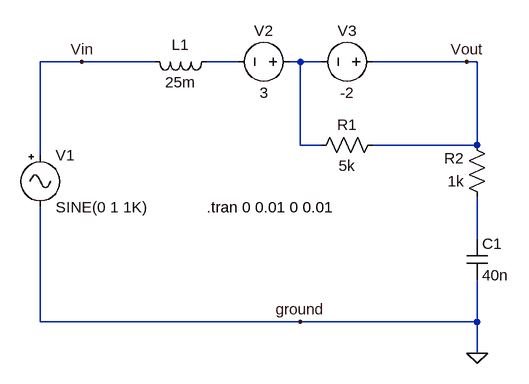
[diagram p0: schematic L__V__V_R__R__C.asc]
L__V__V_R__R__C.asc, the LTspice schematic file:
Version 4
SHEET 1 880 680
WIRE 160 96 96 96
WIRE 272 96 160 96
WIRE 400 96 352 96
WIRE 496 96 480 96
WIRE 528 96 496 96
WIRE 752 96 608 96
WIRE 768 96 752 96
WIRE 496 224 496 96
WIRE 528 224 496 224
WIRE 768 224 768 96
WIRE 768 224 608 224
WIRE 96 240 96 96
WIRE 768 368 768 304
WIRE 96 496 96 320
WIRE 496 496 96 496
WIRE 768 496 768 432
WIRE 768 496 496 496
WIRE 768 544 768 496
FLAG 768 544 0
FLAG 160 96 Vin
FLAG 752 96 Vout
FLAG 496 496 ground
SYMBOL Misc/signal 96 224 R0
SYMATTR InstName V1
SYMBOL ind 368 80 R90
WINDOW 0 5 56 VBottom 2
WINDOW 3 32 56 VTop 2
SYMATTR InstName L1
SYMATTR Value 25m
SYMBOL voltage 496 96 R90
WINDOW 0 -32 56 VBottom 2
WINDOW 3 32 56 VTop 2
SYMATTR InstName V2
SYMATTR Value 3
SYMBOL voltage 624 96 R90
WINDOW 0 -32 56 VBottom 2
WINDOW 3 32 56 VTop 2
SYMATTR InstName V3
SYMATTR Value -2
SYMBOL res 624 208 R90
WINDOW 0 0 56 VBottom 2
WINDOW 3 32 56 VTop 2
SYMATTR InstName R1
SYMATTR Value 5k
SYMBOL res 784 320 R180
WINDOW 0 36 76 Left 2
WINDOW 3 36 40 Left 2
SYMATTR InstName R2
SYMATTR Value 1k
SYMBOL cap 752 368 R0
SYMATTR InstName C1
SYMATTR Value 40n
TEXT 352 320 Left 2 !.tran 0 0.01 0 0.01

The netlist it stands for:
* L__V__V_R__R__C.asc
V1 Vin 0 SINE(0 1 1K)
L1 N001 Vin 25m
V2 N002 N001 3
V3 Vout N002 -2
R1 Vout N002 5k
R2 N003 Vout 1k
C1 N003 0 40n
.tran 0 0.01 0 0.01
.backanno
.end